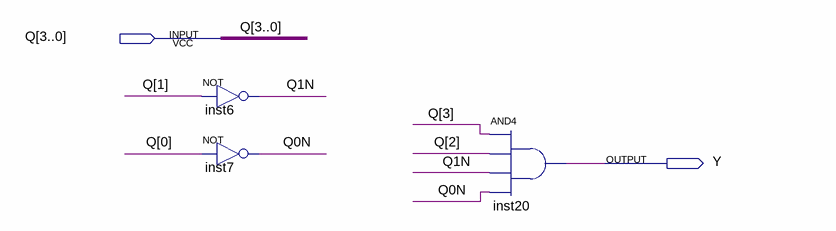
[diagram p0: schematic sheet]
// Quartus schematic OUTPUT_GEN.bdf as structural Verilog: 3 symbols, 2 pins
module OUTPUT_GEN (
  input  [3:0] Q,
  output Y
);

  wire Q0N, Q1N;

  not inst6 (Q1N, Q[1]);
  not inst7 (Q0N, Q[0]);
  and inst20 (Y, Q[3], Q[2], Q1N, Q0N);
endmodule
